# Altium project PCB_Backplane_Board.PrjPcb
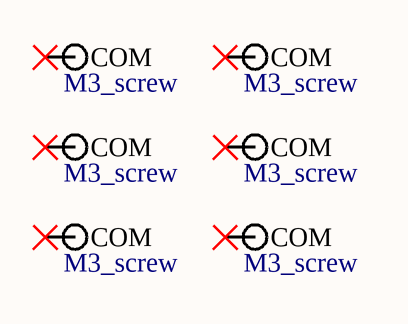
[diagram p0: Main.SchDoc]
10 sheets, 46 parts. Net scope: flat (ports and power ports of the same name join across sheets).
Board file: Backplane_Board.PcbDoc
Sheets:
  Main.SchDoc
  USB_hub.SchDoc
  Outgoing_connectors_1_to_3.SchDoc
  Outgoing_Connector_4.SchDoc
  Incoming_connectors.SchDoc
  SD_Card.SchDoc
  USB_hub2.SchDoc
  Outgoing_connectors_5_to_7.SchDoc
  Outgoing_Connector_8.SchDoc
  Incoming_connectors2.SchDoc

## Sheet Main.SchDoc
size A4

### Parts
TH1  M3_screw  [m3_w_tol_1p9]
TH2  M3_screw  [m3_w_tol_1p9]
TH3  M3_screw  [m3_w_tol_1p9]
TH4  M3_screw  [m3_w_tol_1p9]
TH5  M3_screw  [m3_w_tol_1p9]
TH6  M3_screw  [m3_w_tol_1p9]

### Nets

Not connected (* = marked no-connect by the designer): TH1 0(COM)*; TH2 0(COM)*; TH3 0(COM)*; TH4 0(COM)*; TH5 0(COM)*; TH6 0(COM)*

## Sheet USB_hub.SchDoc
size A4
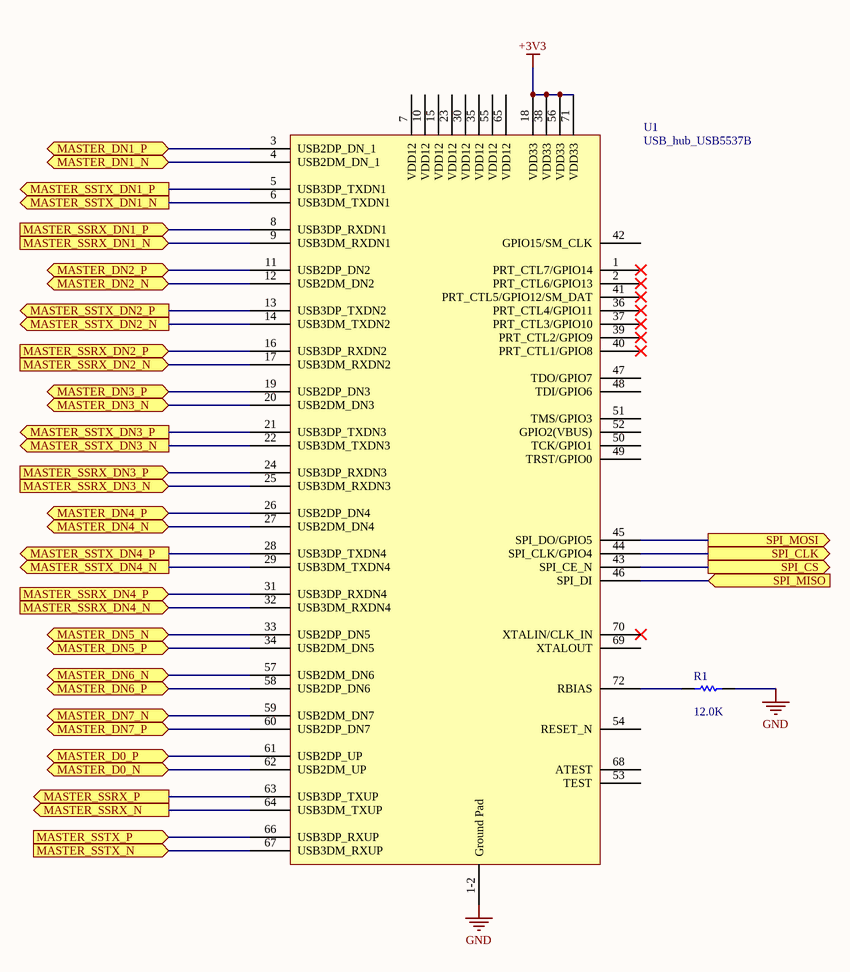
[diagram p1: USB_hub.SchDoc]

### Parts
R1  value 12.0K  [RESC6332]  (hidden comment: Res1)
U1  USB_hub_USB5537B  [QFN50P1000X1000X100_HS-73N]

### Ports
MASTER_D0_N (bidir), MASTER_D0_P (bidir), MASTER_DN1_N (bidir), MASTER_DN1_P (bidir), MASTER_DN2_N (bidir), MASTER_DN2_P (bidir), MASTER_DN3_N (bidir), MASTER_DN3_P (bidir), MASTER_DN4_N (bidir), MASTER_DN4_P (bidir), MASTER_DN5_N (bidir), MASTER_DN5_P (bidir), MASTER_DN6_N (bidir), MASTER_DN6_P (bidir), MASTER_DN7_N (bidir), MASTER_DN7_P (bidir), MASTER_SSRX_DN1_N (in), MASTER_SSRX_DN1_P (in), MASTER_SSRX_DN2_N (in), MASTER_SSRX_DN2_P (in), MASTER_SSRX_DN3_N (in), MASTER_SSRX_DN3_P (in), MASTER_SSRX_DN4_N (in), MASTER_SSRX_DN4_P (in), MASTER_SSRX_N (out), MASTER_SSRX_P (out), MASTER_SSTX_DN1_N (out), MASTER_SSTX_DN1_P (out), MASTER_SSTX_DN2_N (out), MASTER_SSTX_DN2_P (out), MASTER_SSTX_DN3_N (out), MASTER_SSTX_DN3_P (out), MASTER_SSTX_DN4_N (out), MASTER_SSTX_DN4_P (out), MASTER_SSTX_N (in), MASTER_SSTX_P (in), SPI_CLK (out), SPI_CS (out), SPI_MISO (in), SPI_MOSI (out)

### Nets
+3V3: U1.18(VDD33) U1.38(VDD33) U1.56(VDD33) U1.71(VDD33)
GND: R1.2 U1.1-2(Ground_Pad)
MASTER_D0_N: U1.62(USB2DM_UP) ; port MASTER_D0_N
MASTER_D0_P: U1.61(USB2DP_UP) ; port MASTER_D0_P
MASTER_DN1_N: U1.4(USB2DM_DN_1) ; port MASTER_DN1_N
MASTER_DN1_P: U1.3(USB2DP_DN_1) ; port MASTER_DN1_P
MASTER_DN2_N: U1.12(USB2DM_DN2) ; port MASTER_DN2_N
MASTER_DN2_P: U1.11(USB2DP_DN2) ; port MASTER_DN2_P
MASTER_DN3_N: U1.20(USB2DM_DN3) ; port MASTER_DN3_N
MASTER_DN3_P: U1.19(USB2DP_DN3) ; port MASTER_DN3_P
MASTER_DN4_N: U1.27(USB2DM_DN4) ; port MASTER_DN4_N
MASTER_DN4_P: U1.26(USB2DP_DN4) ; port MASTER_DN4_P
MASTER_DN5_N: U1.33(USB2DP_DN5) ; port MASTER_DN5_N
MASTER_DN5_P: U1.34(USB2DM_DN5) ; port MASTER_DN5_P
MASTER_DN6_N: U1.57(USB2DM_DN6) ; port MASTER_DN6_N
MASTER_DN6_P: U1.58(USB2DP_DN6) ; port MASTER_DN6_P
MASTER_DN7_N: U1.59(USB2DM_DN7) ; port MASTER_DN7_N
MASTER_DN7_P: U1.60(USB2DP_DN7) ; port MASTER_DN7_P
MASTER_SSRX_DN1_N: U1.9(USB3DM_RXDN1) ; port MASTER_SSRX_DN1_N
MASTER_SSRX_DN1_P: U1.8(USB3DP_RXDN1) ; port MASTER_SSRX_DN1_P
MASTER_SSRX_DN2_N: U1.17(USB3DM_RXDN2) ; port MASTER_SSRX_DN2_N
MASTER_SSRX_DN2_P: U1.16(USB3DP_RXDN2) ; port MASTER_SSRX_DN2_P
MASTER_SSRX_DN3_N: U1.25(USB3DM_RXDN3) ; port MASTER_SSRX_DN3_N
MASTER_SSRX_DN3_P: U1.24(USB3DP_RXDN3) ; port MASTER_SSRX_DN3_P
MASTER_SSRX_DN4_N: U1.32(USB3DM_RXDN4) ; port MASTER_SSRX_DN4_N
MASTER_SSRX_DN4_P: U1.31(USB3DP_RXDN4) ; port MASTER_SSRX_DN4_P
MASTER_SSRX_N: U1.64(USB3DM_TXUP) ; port MASTER_SSRX_N
MASTER_SSRX_P: U1.63(USB3DP_TXUP) ; port MASTER_SSRX_P
NetC1_2: U1.67(USB3DM_RXUP) ; port MASTER_SSTX_N
NetC2_2: U1.66(USB3DP_RXUP) ; port MASTER_SSTX_P
NetC3_2: U1.22(USB3DM_TXDN3) ; port MASTER_SSTX_DN3_N
NetC4_2: U1.21(USB3DP_TXDN3) ; port MASTER_SSTX_DN3_P
NetC5_2: U1.6(USB3DM_TXDN1) ; port MASTER_SSTX_DN1_N
NetC6_2: U1.5(USB3DP_TXDN1) ; port MASTER_SSTX_DN1_P
NetC7_2: U1.14(USB3DM_TXDN2) ; port MASTER_SSTX_DN2_N
NetC8_2: U1.13(USB3DP_TXDN2) ; port MASTER_SSTX_DN2_P
NetC9_2: U1.29(USB3DM_TXDN4) ; port MASTER_SSTX_DN4_N
NetC10_2: U1.28(USB3DP_TXDN4) ; port MASTER_SSTX_DN4_P
NetJ1_2: U1.43(SPI_CE_N) ; port SPI_CS
NetJ1_3: U1.45(SPI_DO/GPIO5) ; port SPI_MOSI
NetJ1_5: U1.44(SPI_CLK/GPIO4) ; port SPI_CLK
NetJ1_7: U1.46(SPI_DI) ; port SPI_MISO
NetR1_1: R1.1 U1.72(RBIAS)

Not connected (* = marked no-connect by the designer): U1 1(PRT_CTL7/GPIO14)* 2(PRT_CTL6/GPIO13)* 7(VDD12) 10(VDD12) 15(VDD12) 23(VDD12) 30(VDD12) 35(VDD12) 36(PRT_CTL4/GPIO11)* 37(PRT_CTL3/GPIO10)* 39(PRT_CTL2/GPIO9)* 40(PRT_CTL1/GPIO8)* 41(PRT_CTL5/GPIO12/SM_DAT)* 42(GPIO15/SM_CLK) 47(TDO/GPIO7) 48(TDI/GPIO6) 49(TRST/GPIO0) 50(TCK/GPIO1) 51(TMS/GPIO3) 52(GPIO2(VBUS)) 53(TEST) 54(RESET_N) 55(VDD12) 65(VDD12) 68(ATEST) 69(XTALOUT) 70(XTALIN/CLK_IN)*

### Library data of the parts
R1 = Res1: Resistor; Published: 8-Jun-2000; LatestRevisionDate: 17-Jul-2002; LatestRevisionNote: Re-released for DXP Platform.; PackageReference: AXIAL-0.3; Publisher: Altium Limited; PackageDescription: Axial Device, Thru-Hole; 2 Leads; 0.3 in Pin Spacing
U1 = USB_hub_USB5537B: https://media.digikey.com/pdf/Data%20Sheets/Microchip%20PDFs/USB5537B.pdf

## Sheet Outgoing_connectors_1_to_3.SchDoc
size A4
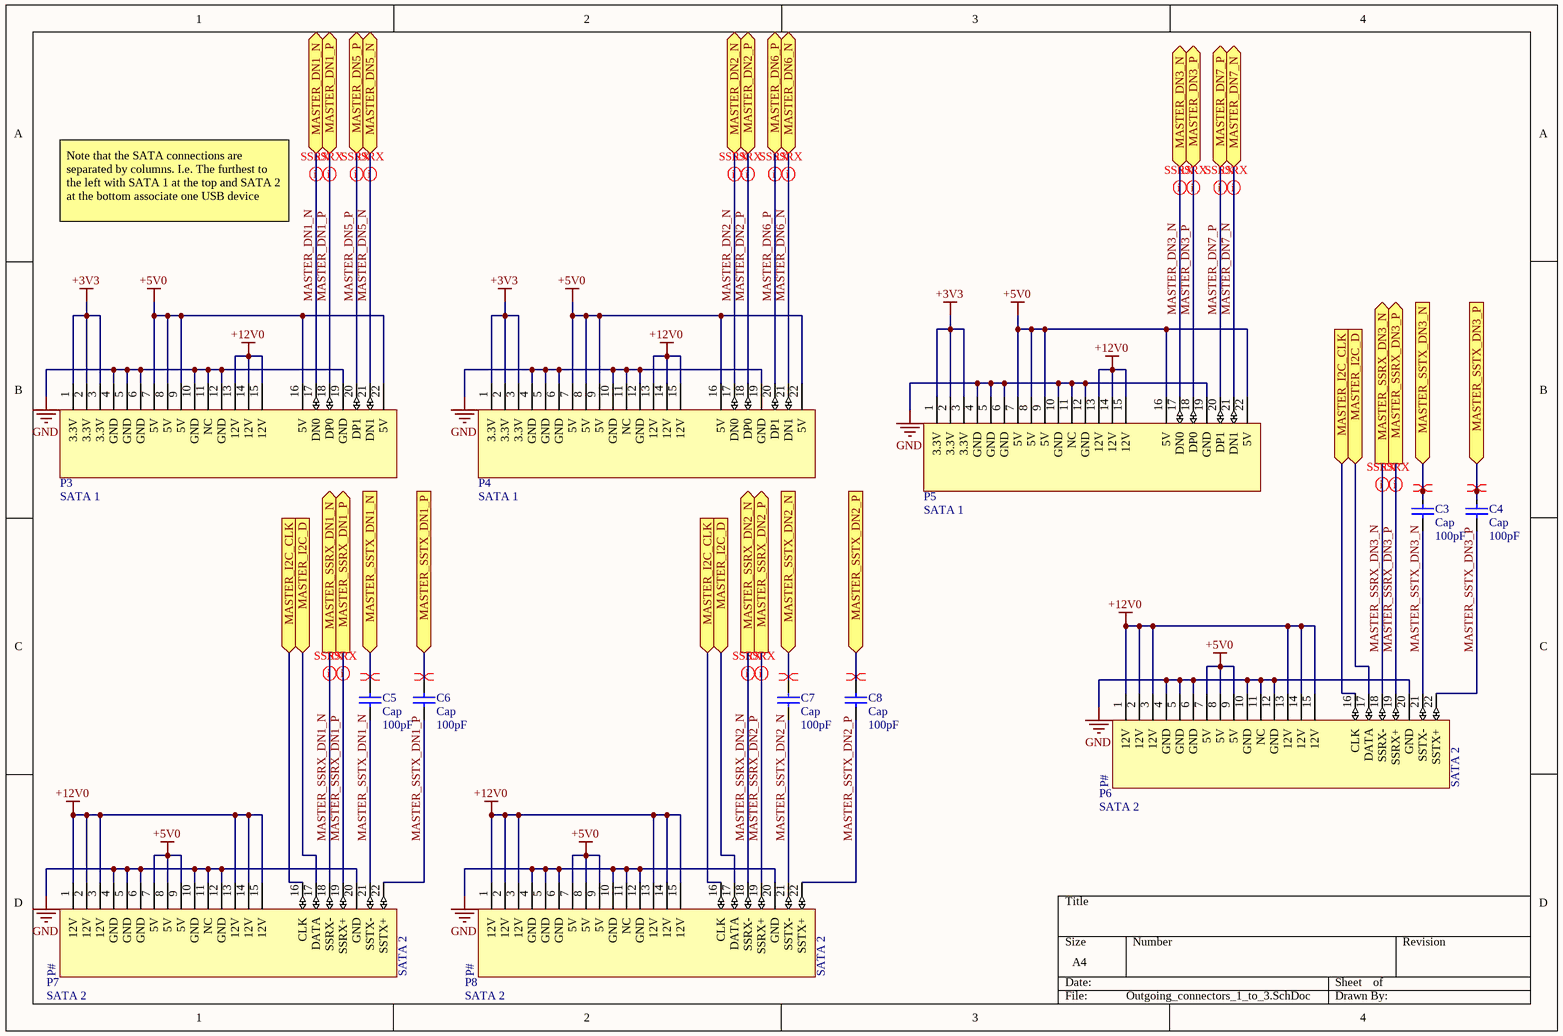
[diagram p2: Outgoing_connectors_1_to_3.SchDoc]

### Parts
C3  Cap  value 100pF  [RAD-0.3]
C4  Cap  value 100pF  [RAD-0.3]
C5  Cap  value 100pF  [RAD-0.3]
C6  Cap  value 100pF  [RAD-0.3]
C7  Cap  value 100pF  [RAD-0.3]
C8  Cap  value 100pF  [RAD-0.3]
P3  SATA 1  [Amphenol 10017660-001LF]
P4  SATA 1  [Amphenol 10017660-001LF]
P5  SATA 1  [Amphenol 10017660-001LF]
P6  SATA 2  [Amphenol 10017660-001LF]
P7  SATA 2  [Amphenol 10017660-001LF]
P8  SATA 2  [Amphenol 10017660-001LF]

### Ports
MASTER_DN1_N (bidir), MASTER_DN1_P (bidir), MASTER_DN2_N (bidir), MASTER_DN2_P (bidir), MASTER_DN3_N (bidir), MASTER_DN3_P (bidir), MASTER_DN5_N (bidir), MASTER_DN5_P (bidir), MASTER_DN6_N (bidir), MASTER_DN6_P (bidir), MASTER_DN7_N (bidir), MASTER_DN7_P (bidir), MASTER_I2C_CLK (in), MASTER_I2C_D (in), MASTER_SSRX_DN1_N (out), MASTER_SSRX_DN1_P (out), MASTER_SSRX_DN2_N (out), MASTER_SSRX_DN2_P (out), MASTER_SSRX_DN3_N (out), MASTER_SSRX_DN3_P (out), MASTER_SSTX_DN1_N (in), MASTER_SSTX_DN1_P (in), MASTER_SSTX_DN2_N (in), MASTER_SSTX_DN2_P (in), MASTER_SSTX_DN3_N (in), MASTER_SSTX_DN3_P (in)

### Nets
+3V3: P3.1(3.3V) P3.2(3.3V) P3.3(3.3V) P4.1(3.3V) P4.2(3.3V) P4.3(3.3V) P5.1(3.3V) P5.2(3.3V) P5.3(3.3V)
+5V0: P3.7(5V) P3.8(5V) P3.9(5V) P3.16(5V) P3.22(5V) P4.7(5V) P4.8(5V) P4.9(5V) P4.16(5V) P4.22(5V) P5.7(5V) P5.8(5V) P5.9(5V) P5.16(5V) P5.22(5V) P6.7(5V) P6.8(5V) P6.9(5V) P7.7(5V) P7.8(5V) P7.9(5V) P8.7(5V) P8.8(5V) P8.9(5V)
+12V0: P3.13(12V) P3.14(12V) P3.15(12V) P4.13(12V) P4.14(12V) P4.15(12V) P5.13(12V) P5.14(12V) P5.15(12V) P6.1(12V) P6.2(12V) P6.3(12V) P6.13(12V) P6.14(12V) P6.15(12V) P7.1(12V) P7.2(12V) P7.3(12V) P7.13(12V) P7.14(12V) P7.15(12V) P8.1(12V) P8.2(12V) P8.3(12V) P8.13(12V) P8.14(12V) P8.15(12V)
GND: P3.4(GND) P3.5(GND) P3.6(GND) P3.10(GND) P3.11(NC) P3.12(GND) P3.19(GND) P4.4(GND) P4.5(GND) P4.6(GND) P4.10(GND) P4.11(NC) P4.12(GND) P4.19(GND) P5.4(GND) P5.5(GND) P5.6(GND) P5.10(GND) P5.11(NC) P5.12(GND) P5.19(GND) P6.4(GND) P6.5(GND) P6.6(GND) P6.10(GND) P6.11(NC) P6.12(GND) P6.20(GND) P7.4(GND) P7.5(GND) P7.6(GND) P7.10(GND) P7.11(NC) P7.12(GND) P7.20(GND) P8.4(GND) P8.5(GND) P8.6(GND) P8.10(GND) P8.11(NC) P8.12(GND) P8.20(GND)
MASTER_DN1_N: P3.17(DN0) ; port MASTER_DN1_N
MASTER_DN1_P: P3.18(DP0) ; port MASTER_DN1_P
MASTER_DN2_N: P4.17(DN0) ; port MASTER_DN2_N
MASTER_DN2_P: P4.18(DP0) ; port MASTER_DN2_P
MASTER_DN3_N: P5.17(DN0) ; port MASTER_DN3_N
MASTER_DN3_P: P5.18(DP0) ; port MASTER_DN3_P
MASTER_DN5_N: P3.21(DN1) ; port MASTER_DN5_N
MASTER_DN5_P: P3.20(DP1) ; port MASTER_DN5_P
MASTER_DN6_N: P4.21(DN1) ; port MASTER_DN6_N
MASTER_DN6_P: P4.20(DP1) ; port MASTER_DN6_P
MASTER_DN7_N: P5.21(DN1) ; port MASTER_DN7_N
MASTER_DN7_P: P5.20(DP1) ; port MASTER_DN7_P
MASTER_SSRX_DN1_N: P7.18(SSRX-) ; port MASTER_SSRX_DN1_N
MASTER_SSRX_DN1_P: P7.19(SSRX+) ; port MASTER_SSRX_DN1_P
MASTER_SSRX_DN2_N: P8.18(SSRX-) ; port MASTER_SSRX_DN2_N
MASTER_SSRX_DN2_P: P8.19(SSRX+) ; port MASTER_SSRX_DN2_P
MASTER_SSRX_DN3_N: P6.18(SSRX-) ; port MASTER_SSRX_DN3_N
MASTER_SSRX_DN3_P: P6.19(SSRX+) ; port MASTER_SSRX_DN3_P
MASTER_SSTX_DN1_N: C5.1 P7.21(SSTX-)
MASTER_SSTX_DN1_P: C6.1 P7.22(SSTX+)
MASTER_SSTX_DN2_N: C7.1 P8.21(SSTX-)
MASTER_SSTX_DN2_P: C8.1 P8.22(SSTX+)
MASTER_SSTX_DN3_N: C3.1 P6.21(SSTX-)
MASTER_SSTX_DN3_P: C4.1 P6.22(SSTX+)
NetC3_2: C3.2 ; port MASTER_SSTX_DN3_N
NetC4_2: C4.2 ; port MASTER_SSTX_DN3_P
NetC5_2: C5.2 ; port MASTER_SSTX_DN1_N
NetC6_2: C6.2 ; port MASTER_SSTX_DN1_P
NetC7_2: C7.2 ; port MASTER_SSTX_DN2_N
NetC8_2: C8.2 ; port MASTER_SSTX_DN2_P
NetP2_16: P6.16(CLK) P7.16(CLK) P8.16(CLK) ; port MASTER_I2C_CLK
NetP2_17: P6.17(DATA) P7.17(DATA) P8.17(DATA) ; port MASTER_I2C_D

### Layout directives
differential pair; rule Signal Stimulus [Kind - Single Pulse    Level - High    Start Time = 0.000    Stop Time = 200.0p    Period Time = 400.0p]: (no net found under the mark), MASTER_DN1_N, MASTER_DN1_P, MASTER_DN2_N, MASTER_DN2_P, MASTER_DN3_N, MASTER_DN3_P, MASTER_DN5_N, MASTER_DN5_P, MASTER_DN6_N, MASTER_DN6_P, MASTER_DN7_N, MASTER_DN7_P, MASTER_SSRX_DN1_N, MASTER_SSRX_DN1_P, MASTER_SSRX_DN2_N, MASTER_SSRX_DN2_P, MASTER_SSRX_DN3_N, MASTER_SSRX_DN3_P

### Notes on the sheet
- Note that the SATA connections are separated by columns. I.e. The furthest to the left with SATA 1 at the top and SATA 2 at the bottom associate one USB device
- (in symbol SATA 2) P#

### Library data of the parts
C3-C8 = Cap: Capacitor; Published: 8-Jun-2000; LatestRevisionDate: 17-Jul-2002; LatestRevisionNote: Re-released for DXP Platform.; PackageReference: RAD-0.3; Publisher: Altium Limited; PackageDescription: Radial Cap, Thru-Hole; 2 Leads; 0.3 in Pin Spacing
P3-P5 = SATA 1: SATA connector. / Connector 1 for option 1 as per Spec; Supplier 1: Digi-Key
P6-P8 = SATA 2: SATA connector. / Connector 2 for option 1 as per Spec; Supplier 1: Digi-Key

## Sheet Outgoing_Connector_4.SchDoc
size A4
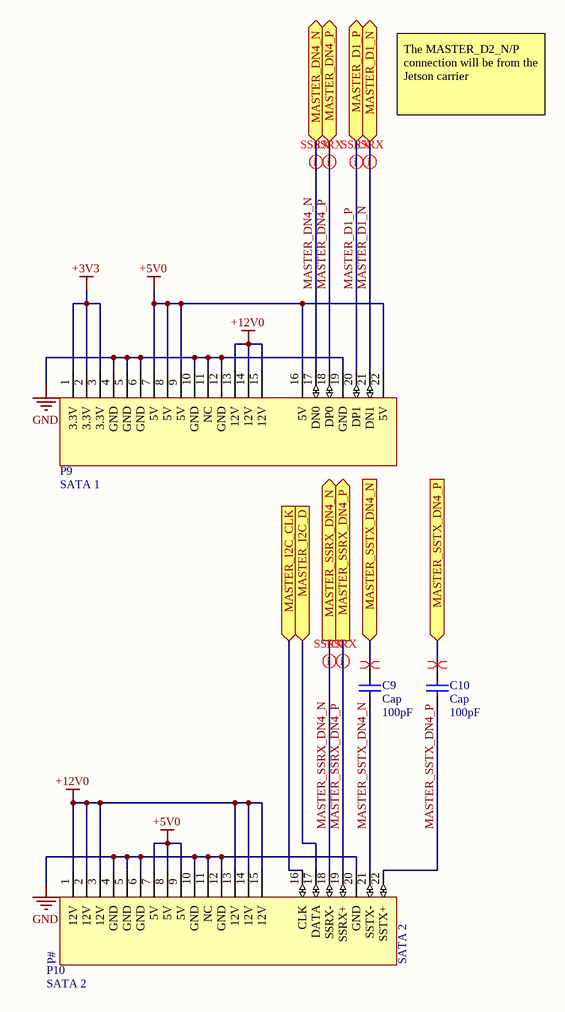
[diagram p3: Outgoing_Connector_4.SchDoc]

### Parts
C9  Cap  value 100pF  [RAD-0.3]
C10  Cap  value 100pF  [RAD-0.3]
P9  SATA 1  [Amphenol 10017660-001LF]
P10  SATA 2  [Amphenol 10017660-001LF]

### Ports
MASTER_D1_N (bidir), MASTER_D1_P (bidir), MASTER_DN4_N (bidir), MASTER_DN4_P (bidir), MASTER_I2C_CLK (in), MASTER_I2C_D (in), MASTER_SSRX_DN4_N (out), MASTER_SSRX_DN4_P (out), MASTER_SSTX_DN4_N (in), MASTER_SSTX_DN4_P (in)

### Nets
+3V3: P9.1(3.3V) P9.2(3.3V) P9.3(3.3V)
+5V0: P9.7(5V) P9.8(5V) P9.9(5V) P9.16(5V) P9.22(5V) P10.7(5V) P10.8(5V) P10.9(5V)
+12V0: P9.13(12V) P9.14(12V) P9.15(12V) P10.1(12V) P10.2(12V) P10.3(12V) P10.13(12V) P10.14(12V) P10.15(12V)
GND: P9.4(GND) P9.5(GND) P9.6(GND) P9.10(GND) P9.11(NC) P9.12(GND) P9.19(GND) P10.4(GND) P10.5(GND) P10.6(GND) P10.10(GND) P10.11(NC) P10.12(GND) P10.20(GND)
MASTER_D1_N: P9.21(DN1) ; port MASTER_D1_N
MASTER_D1_P: P9.20(DP1) ; port MASTER_D1_P
MASTER_DN4_N: P9.17(DN0) ; port MASTER_DN4_N
MASTER_DN4_P: P9.18(DP0) ; port MASTER_DN4_P
MASTER_SSRX_DN4_N: P10.18(SSRX-) ; port MASTER_SSRX_DN4_N
MASTER_SSRX_DN4_P: P10.19(SSRX+) ; port MASTER_SSRX_DN4_P
MASTER_SSTX_DN4_N: C9.1 P10.21(SSTX-)
MASTER_SSTX_DN4_P: C10.1 P10.22(SSTX+)
NetC9_2: C9.2 ; port MASTER_SSTX_DN4_N
NetC10_2: C10.2 ; port MASTER_SSTX_DN4_P
NetP2_16: P10.16(CLK) ; port MASTER_I2C_CLK
NetP2_17: P10.17(DATA) ; port MASTER_I2C_D

### Layout directives
differential pair; rule Signal Stimulus [Kind - Single Pulse    Level - High    Start Time = 0.000    Stop Time = 200.0p    Period Time = 400.0p]: (no net found under the mark), MASTER_D1_N, MASTER_D1_P, MASTER_DN4_N, MASTER_DN4_P, MASTER_SSRX_DN4_N, MASTER_SSRX_DN4_P

### Notes on the sheet
- The MASTER_D2_N/P connection will be from the Jetson carrier
- (in symbol SATA 2) P#

### Library data of the parts
C9 C10 = Cap: Capacitor; Published: 8-Jun-2000; LatestRevisionDate: 17-Jul-2002; LatestRevisionNote: Re-released for DXP Platform.; PackageReference: RAD-0.3; Publisher: Altium Limited; PackageDescription: Radial Cap, Thru-Hole; 2 Leads; 0.3 in Pin Spacing
P9 = SATA 1: as P3 on sheet Outgoing_connectors_1_to_3; Supplier 1: Digi-Key
P10 = SATA 2: as P6 on sheet Outgoing_connectors_1_to_3; Supplier 1: Digi-Key

## Sheet Incoming_connectors.SchDoc
size A4
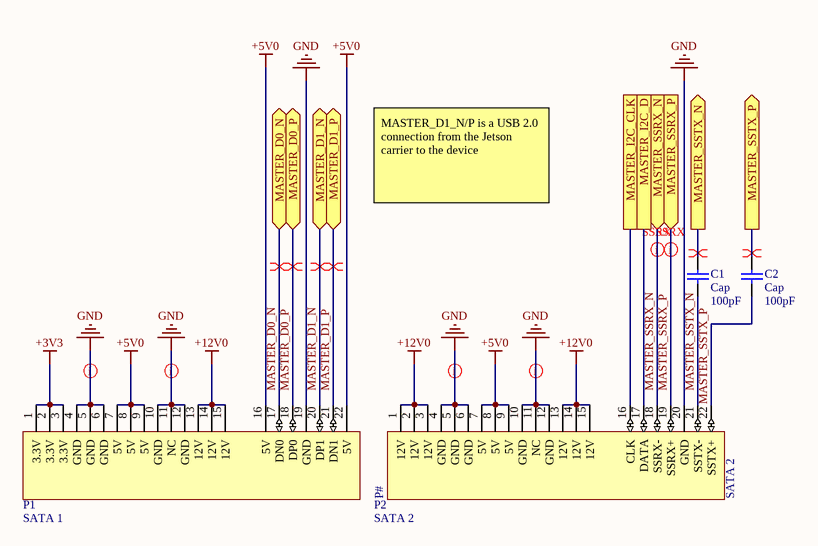
[diagram p4: Incoming_connectors.SchDoc]

### Parts
C1  Cap  value 100pF  [RAD-0.3]
C2  Cap  value 100pF  [RAD-0.3]
P1  SATA 1  [Amphenol 10017660-001LF]
P2  SATA 2  [Amphenol 10017660-001LF]

### Ports
MASTER_D0_N (bidir), MASTER_D0_P (bidir), MASTER_D1_N (bidir), MASTER_D1_P (bidir), MASTER_I2C_CLK, MASTER_I2C_D, MASTER_SSRX_N (in), MASTER_SSRX_P (in), MASTER_SSTX_N (out), MASTER_SSTX_P (out)

### Nets
+3V3: P1.1(3.3V) P1.2(3.3V) P1.3(3.3V)
+5V0: P1.7(5V) P1.8(5V) P1.9(5V) P1.16(5V) P1.22(5V) P2.7(5V) P2.8(5V) P2.9(5V)
+12V0: P1.13(12V) P1.14(12V) P1.15(12V) P2.1(12V) P2.2(12V) P2.3(12V) P2.13(12V) P2.14(12V) P2.15(12V)
GND: P1.4(GND) P1.5(GND) P1.6(GND) P1.10(GND) P1.11(NC) P1.12(GND) P1.19(GND) P2.4(GND) P2.5(GND) P2.6(GND) P2.10(GND) P2.11(NC) P2.12(GND) P2.20(GND)
MASTER_D0_N: P1.17(DN0) ; port MASTER_D0_N
MASTER_D0_P: P1.18(DP0) ; port MASTER_D0_P
MASTER_D1_N: P1.20(DP1) ; port MASTER_D1_N
MASTER_D1_P: P1.21(DN1) ; port MASTER_D1_P
MASTER_SSRX_N: P2.18(SSRX-) ; port MASTER_SSRX_N
MASTER_SSRX_P: P2.19(SSRX+) ; port MASTER_SSRX_P
MASTER_SSTX_N: C1.1 P2.21(SSTX-)
MASTER_SSTX_P: C2.1 P2.22(SSTX+)
NetC1_2: C1.2 ; port MASTER_SSTX_N
NetC2_2: C2.2 ; port MASTER_SSTX_P
NetP2_16: P2.16(CLK) ; port MASTER_I2C_CLK
NetP2_17: P2.17(DATA) ; port MASTER_I2C_D

### Layout directives
rule Width Constraint [Pref Width = 75mil    Min Width = 50mil    Max Width = 1000mil]: GND
differential pair; rule Signal Stimulus [Kind - Single Pulse    Level - High    Start Time = 0.000    Stop Time = 200.0p    Period Time = 400.0p]: (no net found under the mark), MASTER_SSRX_N, MASTER_SSRX_P
differential pair; rule Signal Stimulus [Kind - Single Pulse    Level - High    Start Time = 0.000    Stop Time = 2.083n    Period Time = 4.167n]: MASTER_D0_N, MASTER_D0_P, MASTER_D1_N, MASTER_D1_P

### Notes on the sheet
- MASTER_D1_N/P is a USB 2.0  connection from the Jetson carrier to the device
- (in symbol SATA 2) P#

### Library data of the parts
C1 C2 = Cap: Capacitor; Published: 8-Jun-2000; LatestRevisionDate: 17-Jul-2002; LatestRevisionNote: Re-released for DXP Platform.; PackageReference: RAD-0.3; Publisher: Altium Limited; PackageDescription: Radial Cap, Thru-Hole; 2 Leads; 0.3 in Pin Spacing
P1 = SATA 1: as P3 on sheet Outgoing_connectors_1_to_3; Supplier 1: Digi-Key
P2 = SATA 2: as P6 on sheet Outgoing_connectors_1_to_3; Supplier 1: Digi-Key

## Sheet SD_Card.SchDoc
size A4
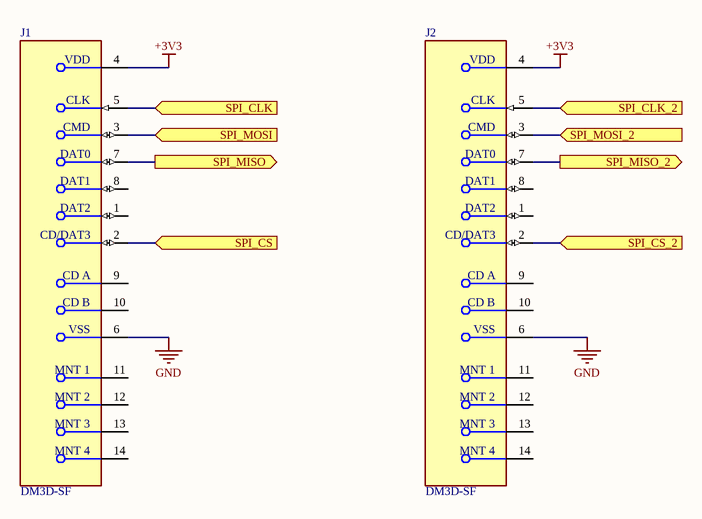
[diagram p5: SD_Card.SchDoc]

### Parts
J1  DM3D-SF  [FP-DM3D-SF-MFG]
J2  DM3D-SF  [FP-DM3D-SF-MFG]

### Ports
SPI_CLK (in), SPI_CLK_2 (in), SPI_CS (in), SPI_CS_2 (in), SPI_MISO (out), SPI_MISO_2 (out), SPI_MOSI (in), SPI_MOSI_2 (in)

### Nets
+3V3: J1.4(VDD) J2.4(VDD)
GND: J1.6(VSS) J2.6(VSS)
NetJ1_2: J1.2(CD/DAT3) ; port SPI_CS
NetJ1_3: J1.3(CMD) ; port SPI_MOSI
NetJ1_5: J1.5(CLK) ; port SPI_CLK
NetJ1_7: J1.7(DAT0) ; port SPI_MISO
NetJ2_2: J2.2(CD/DAT3) ; port SPI_CS_2
NetJ2_3: J2.3(CMD) ; port SPI_MOSI_2
NetJ2_5: J2.5(CLK) ; port SPI_CLK_2
NetJ2_7: J2.7(DAT0) ; port SPI_MISO_2

Not connected (* = marked no-connect by the designer): J1 1(DAT2) 8(DAT1) 9(CD_A) 10(CD_B) 11(MNT_1) 12(MNT_2) 13(MNT_3) 14(MNT_4); J2 1(DAT2) 8(DAT1) 9(CD_A) 10(CD_B) 11(MNT_1) 12(MNT_2) 13(MNT_3) 14(MNT_4)

### Library data of the parts
J1 J2 = CMP-2000-06166-2: CONN MICRO SD CARD PUSH-PULL; Insulation Resistance: 1GR; Max Voltage Rating (AC): 125V; Gender: Female; Contact Resistance: 100mR; Current Rating: 500mA; Pitch: 1.1mm; Connector Type: Connector; Number of Contacts: 8; Contact Plating: Gold; Number of Rows: 1; Termination: Solder; Contact Material: Copper Alloy; REACH SVHC: No SVHC; Voltage Rating (AC): 125V; Packaging: Tape and Reel; Housing Material: Polymer; Max Operating Temperature: 85°C; Package Quantity: 1; Min Operating Temperature: -25°C; Lead Free: Lead Free; Orientation: Right Angle; Radiation Hardening: No; Flammability Rating: UL94 V-0; Mount: Surface Mount; Depth: 11.45mm; Max Current Rating: 500mA; Length: 11.95mm; Width: 11.95mm

## Sheet USB_hub2.SchDoc
size A4
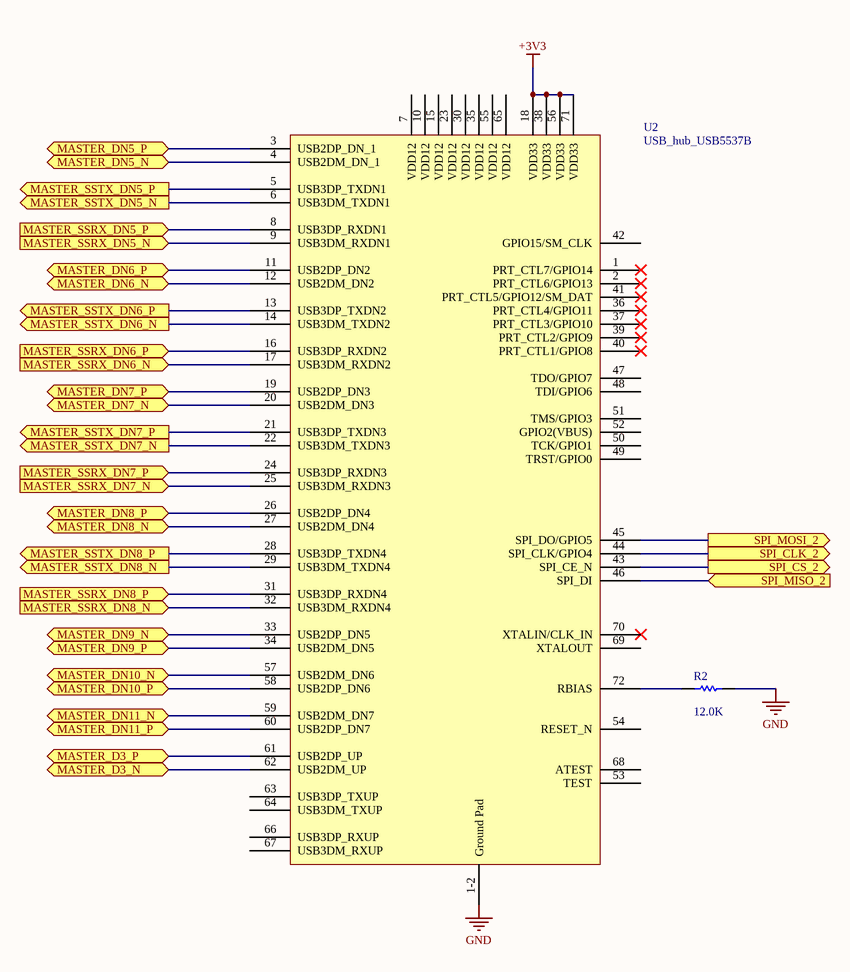
[diagram p6: USB_hub2.SchDoc]

### Parts
R2  value 12.0K  [RESC6332]  (hidden comment: Res1)
U2  USB_hub_USB5537B  [QFN50P1000X1000X100_HS-73N]

### Ports
MASTER_D3_N (bidir), MASTER_D3_P (bidir), MASTER_DN5_N (bidir), MASTER_DN5_P (bidir), MASTER_DN6_N (bidir), MASTER_DN6_P (bidir), MASTER_DN7_N (bidir), MASTER_DN7_P (bidir), MASTER_DN8_N (bidir), MASTER_DN8_P (bidir), MASTER_DN9_N (bidir), MASTER_DN9_P (bidir), MASTER_DN10_N (bidir), MASTER_DN10_P (bidir), MASTER_DN11_N (bidir), MASTER_DN11_P (bidir), MASTER_SSRX_DN5_N (in), MASTER_SSRX_DN5_P (in), MASTER_SSRX_DN6_N (in), MASTER_SSRX_DN6_P (in), MASTER_SSRX_DN7_N (in), MASTER_SSRX_DN7_P (in), MASTER_SSRX_DN8_N (in), MASTER_SSRX_DN8_P (in), MASTER_SSTX_DN5_N (out), MASTER_SSTX_DN5_P (out), MASTER_SSTX_DN6_N (out), MASTER_SSTX_DN6_P (out), MASTER_SSTX_DN7_N (out), MASTER_SSTX_DN7_P (out), MASTER_SSTX_DN8_N (out), MASTER_SSTX_DN8_P (out), SPI_CLK_2 (out), SPI_CS_2 (out), SPI_MISO_2 (in), SPI_MOSI_2 (out)

### Nets
+3V3: U2.18(VDD33) U2.38(VDD33) U2.56(VDD33) U2.71(VDD33)
GND: R2.2 U2.1-2(Ground_Pad)
 MASTER_DN8_N: U2.27(USB2DM_DN4) ; port MASTER_DN8_N
 MASTER_DN8_P: U2.26(USB2DP_DN4) ; port MASTER_DN8_P
MASTER_D3_N: U2.62(USB2DM_UP) ; port MASTER_D3_N
MASTER_D3_P: U2.61(USB2DP_UP) ; port MASTER_D3_P
MASTER_DN5_N: U2.4(USB2DM_DN_1) ; port MASTER_DN5_N
MASTER_DN5_P: U2.3(USB2DP_DN_1) ; port MASTER_DN5_P
MASTER_DN6_N: U2.12(USB2DM_DN2) ; port MASTER_DN6_N
MASTER_DN6_P: U2.11(USB2DP_DN2) ; port MASTER_DN6_P
MASTER_DN7_N: U2.20(USB2DM_DN3) ; port MASTER_DN7_N
MASTER_DN7_P: U2.19(USB2DP_DN3) ; port MASTER_DN7_P
MASTER_DN9_N: U2.33(USB2DP_DN5) ; port MASTER_DN9_N
MASTER_DN9_P: U2.34(USB2DM_DN5) ; port MASTER_DN9_P
MASTER_DN10_N: U2.57(USB2DM_DN6) ; port MASTER_DN10_N
MASTER_DN10_P: U2.58(USB2DP_DN6) ; port MASTER_DN10_P
MASTER_DN11_N: U2.59(USB2DM_DN7) ; port MASTER_DN11_N
MASTER_DN11_P: U2.60(USB2DP_DN7) ; port MASTER_DN11_P
MASTER_SSRX_DN5_N: U2.9(USB3DM_RXDN1) ; port MASTER_SSRX_DN5_N
MASTER_SSRX_DN5_P: U2.8(USB3DP_RXDN1) ; port MASTER_SSRX_DN5_P
MASTER_SSRX_DN6_N: U2.17(USB3DM_RXDN2) ; port MASTER_SSRX_DN6_N
MASTER_SSRX_DN6_P: U2.16(USB3DP_RXDN2) ; port MASTER_SSRX_DN6_P
MASTER_SSRX_DN7_N: U2.25(USB3DM_RXDN3) ; port MASTER_SSRX_DN7_N
MASTER_SSRX_DN7_P: U2.24(USB3DP_RXDN3) ; port MASTER_SSRX_DN7_P
MASTER_SSRX_DN8_N: U2.32(USB3DM_RXDN4) ; port MASTER_SSRX_DN8_N
MASTER_SSRX_DN8_P: U2.31(USB3DP_RXDN4) ; port MASTER_SSRX_DN8_P
NetC11_1: U2.13(USB3DP_TXDN2) ; port MASTER_SSTX_DN6_P
NetC12_1: U2.14(USB3DM_TXDN2) ; port MASTER_SSTX_DN6_N
NetC13_2: U2.21(USB3DP_TXDN3) ; port MASTER_SSTX_DN7_P
NetC14_2: U2.22(USB3DM_TXDN3) ; port MASTER_SSTX_DN7_N
NetC15_2: U2.6(USB3DM_TXDN1) ; port MASTER_SSTX_DN5_N
NetC16_2: U2.5(USB3DP_TXDN1) ; port MASTER_SSTX_DN5_P
NetC17_2: U2.28(USB3DP_TXDN4) ; port MASTER_SSTX_DN8_P
NetC18_2: U2.29(USB3DM_TXDN4) ; port MASTER_SSTX_DN8_N
NetJ2_2: U2.43(SPI_CE_N) ; port SPI_CS_2
NetJ2_3: U2.45(SPI_DO/GPIO5) ; port SPI_MOSI_2
NetJ2_5: U2.44(SPI_CLK/GPIO4) ; port SPI_CLK_2
NetJ2_7: U2.46(SPI_DI) ; port SPI_MISO_2
NetR2_1: R2.1 U2.72(RBIAS)

Not connected (* = marked no-connect by the designer): U2 1(PRT_CTL7/GPIO14)* 2(PRT_CTL6/GPIO13)* 7(VDD12) 10(VDD12) 15(VDD12) 23(VDD12) 30(VDD12) 35(VDD12) 36(PRT_CTL4/GPIO11)* 37(PRT_CTL3/GPIO10)* 39(PRT_CTL2/GPIO9)* 40(PRT_CTL1/GPIO8)* 41(PRT_CTL5/GPIO12/SM_DAT)* 42(GPIO15/SM_CLK) 47(TDO/GPIO7) 48(TDI/GPIO6) 49(TRST/GPIO0) 50(TCK/GPIO1) 51(TMS/GPIO3) 52(GPIO2(VBUS)) 53(TEST) 54(RESET_N) 55(VDD12) 63(USB3DP_TXUP) 64(USB3DM_TXUP) 65(VDD12) 66(USB3DP_RXUP) 67(USB3DM_RXUP) 68(ATEST) 69(XTALOUT) 70(XTALIN/CLK_IN)*

### Library data of the parts
R2 = Res1: Resistor; Published: 8-Jun-2000; LatestRevisionDate: 17-Jul-2002; LatestRevisionNote: Re-released for DXP Platform.; PackageReference: AXIAL-0.3; Publisher: Altium Limited; PackageDescription: Axial Device, Thru-Hole; 2 Leads; 0.3 in Pin Spacing
U2 = USB_hub_USB5537B: as U1 on sheet USB_hub

## Sheet Outgoing_connectors_5_to_7.SchDoc
size A4
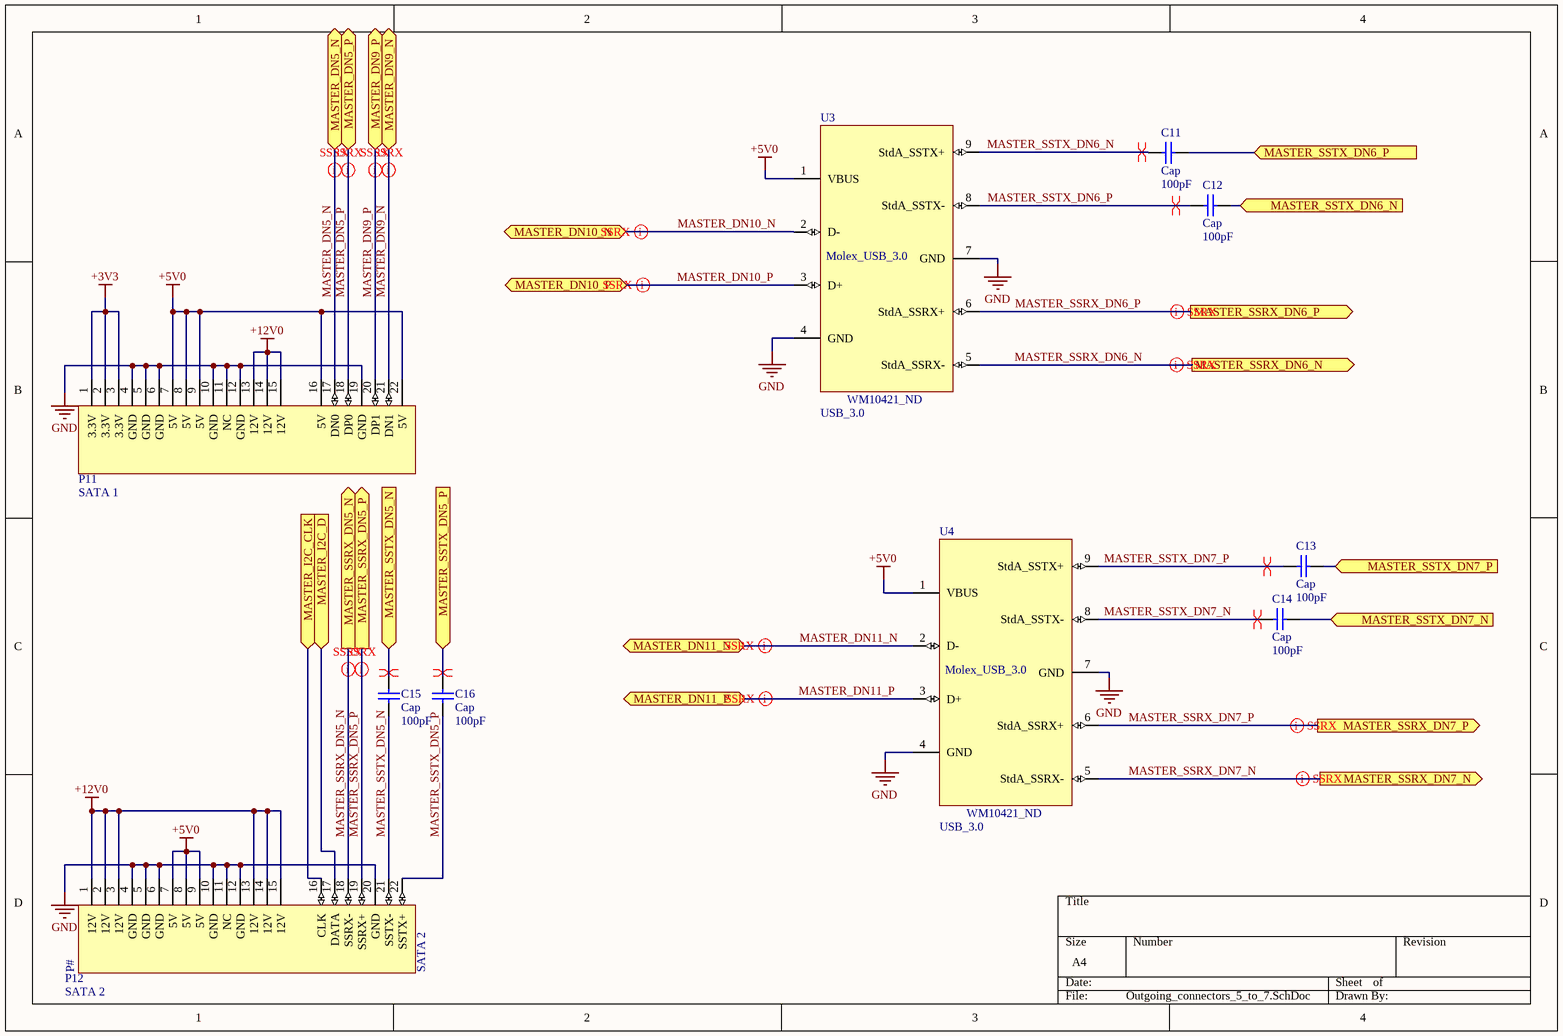
[diagram p7: Outgoing_connectors_5_to_7.SchDoc]

### Parts
C11  Cap  value 100pF  [RAD-0.3]
C12  Cap  value 100pF  [RAD-0.3]
C13  Cap  value 100pF  [RAD-0.3]
C14  Cap  value 100pF  [RAD-0.3]
C15  Cap  value 100pF  [RAD-0.3]
C16  Cap  value 100pF  [RAD-0.3]
P11  SATA 1  [Amphenol 10017660-001LF]
P12  SATA 2  [Amphenol 10017660-001LF]
U3  USB_3.0  [Molex_USB_3.0_WM10421_ND]
U4  USB_3.0  [Molex_USB_3.0_WM10421_ND]

### Ports
MASTER_DN5_N (bidir), MASTER_DN5_P (bidir), MASTER_DN9_N (bidir), MASTER_DN9_P (bidir), MASTER_DN10_N (bidir), MASTER_DN10_P (bidir), MASTER_DN11_N (bidir), MASTER_DN11_P (bidir), MASTER_I2C_CLK (in), MASTER_I2C_D (in), MASTER_SSRX_DN5_N (out), MASTER_SSRX_DN5_P (out), MASTER_SSRX_DN6_N (out), MASTER_SSRX_DN6_P (out), MASTER_SSRX_DN7_N (out), MASTER_SSRX_DN7_P (out), MASTER_SSTX_DN5_N (in), MASTER_SSTX_DN5_P (in), MASTER_SSTX_DN6_N (in), MASTER_SSTX_DN6_P (in), MASTER_SSTX_DN7_N (in), MASTER_SSTX_DN7_P (in)

### Nets
+3V3: P11.1(3.3V) P11.2(3.3V) P11.3(3.3V)
+5V0: P11.7(5V) P11.8(5V) P11.9(5V) P11.16(5V) P11.22(5V) P12.7(5V) P12.8(5V) P12.9(5V) U3.1(VBUS) U4.1(VBUS)
+12V0: P11.13(12V) P11.14(12V) P11.15(12V) P12.1(12V) P12.2(12V) P12.3(12V) P12.13(12V) P12.14(12V) P12.15(12V)
GND: P11.4(GND) P11.5(GND) P11.6(GND) P11.10(GND) P11.11(NC) P11.12(GND) P11.19(GND) P12.4(GND) P12.5(GND) P12.6(GND) P12.10(GND) P12.11(NC) P12.12(GND) P12.20(GND) U3.4(GND) U3.7(GND) U4.4(GND) U4.7(GND)
MASTER_DN5_N: P11.17(DN0) ; port MASTER_DN5_N
MASTER_DN5_P: P11.18(DP0) ; port MASTER_DN5_P
MASTER_DN9_N: P11.21(DN1) ; port MASTER_DN9_N
MASTER_DN9_P: P11.20(DP1) ; port MASTER_DN9_P
MASTER_DN10_N: U3.2(D-) ; port MASTER_DN10_N
MASTER_DN10_P: U3.3(D+) ; port MASTER_DN10_P
MASTER_DN11_N: U4.2(D-) ; port MASTER_DN11_N
MASTER_DN11_P: U4.3(D+) ; port MASTER_DN11_P
MASTER_SSRX_DN5_N: P12.18(SSRX-) ; port MASTER_SSRX_DN5_N
MASTER_SSRX_DN5_P: P12.19(SSRX+) ; port MASTER_SSRX_DN5_P
MASTER_SSRX_DN6_N: U3.5(StdA_SSRX-) ; port MASTER_SSRX_DN6_N
MASTER_SSRX_DN6_P: U3.6(StdA_SSRX+) ; port MASTER_SSRX_DN6_P
MASTER_SSRX_DN7_N: U4.5(StdA_SSRX-) ; port MASTER_SSRX_DN7_N
MASTER_SSRX_DN7_P: U4.6(StdA_SSRX+) ; port MASTER_SSRX_DN7_P
MASTER_SSTX_DN5_N: C15.1 P12.21(SSTX-)
MASTER_SSTX_DN5_P: C16.1 P12.22(SSTX+)
MASTER_SSTX_DN6_N: C11.2 U3.9(StdA_SSTX+)
MASTER_SSTX_DN6_P: C12.2 U3.8(StdA_SSTX-)
MASTER_SSTX_DN7_N: C14.1 U4.8(StdA_SSTX-)
MASTER_SSTX_DN7_P: C13.1 U4.9(StdA_SSTX+)
NetC11_1: C11.1 ; port MASTER_SSTX_DN6_P
NetC12_1: C12.1 ; port MASTER_SSTX_DN6_N
NetC13_2: C13.2 ; port MASTER_SSTX_DN7_P
NetC14_2: C14.2 ; port MASTER_SSTX_DN7_N
NetC15_2: C15.2 ; port MASTER_SSTX_DN5_N
NetC16_2: C16.2 ; port MASTER_SSTX_DN5_P
NetP2_16: P12.16(CLK) ; port MASTER_I2C_CLK
NetP2_17: P12.17(DATA) ; port MASTER_I2C_D

### Layout directives
differential pair; rule Signal Stimulus [Kind - Single Pulse    Level - High    Start Time = 0.000    Stop Time = 200.0p    Period Time = 400.0p]: (no net found under the mark), MASTER_DN5_N, MASTER_DN5_P, MASTER_DN9_N, MASTER_DN9_P, MASTER_DN10_N, MASTER_DN10_P, MASTER_DN11_N, MASTER_DN11_P, MASTER_SSRX_DN5_N, MASTER_SSRX_DN5_P, MASTER_SSRX_DN6_N, MASTER_SSRX_DN6_P, MASTER_SSRX_DN7_N, MASTER_SSRX_DN7_P, MASTER_SSTX_DN7_N, MASTER_SSTX_DN7_P
differential pair: MASTER_SSTX_DN6_N, MASTER_SSTX_DN6_P

### Notes on the sheet
- (in symbol Molex_USB_3.0_WM10421_ND) Molex_USB_3.0; WM10421_ND
- (in symbol SATA 2) P#

### Library data of the parts
C11-C16 = Cap: Capacitor; Published: 8-Jun-2000; LatestRevisionDate: 17-Jul-2002; LatestRevisionNote: Re-released for DXP Platform.; PackageReference: RAD-0.3; Publisher: Altium Limited; PackageDescription: Radial Cap, Thru-Hole; 2 Leads; 0.3 in Pin Spacing
P11 = SATA 1: as P3 on sheet Outgoing_connectors_1_to_3; Supplier 1: Digi-Key
P12 = SATA 2: as P6 on sheet Outgoing_connectors_1_to_3; Supplier 1: Digi-Key
U3 U4 = Molex_USB_3.0_WM10421_ND: USB 3.0 Type A Receptacle Connector 9 Position Through Hole; Manufacturer: Molex; Manufacturer Profuct #: 0484080003; Price (CAD): 1.98; ComponentLink1Description: Datasheet; ComponentLink1URL: media.digikey.com/pdf/Data%20Sheets/Molex%20PDFs/48408-001_Pkg%20Spec.pdf; ComponentLink2Description: Datasheet_Model; ComponentLink2URL: molex.com/pdm_docs/sd/484080003_sd.pdf

## Sheet Outgoing_Connector_8.SchDoc
size A4
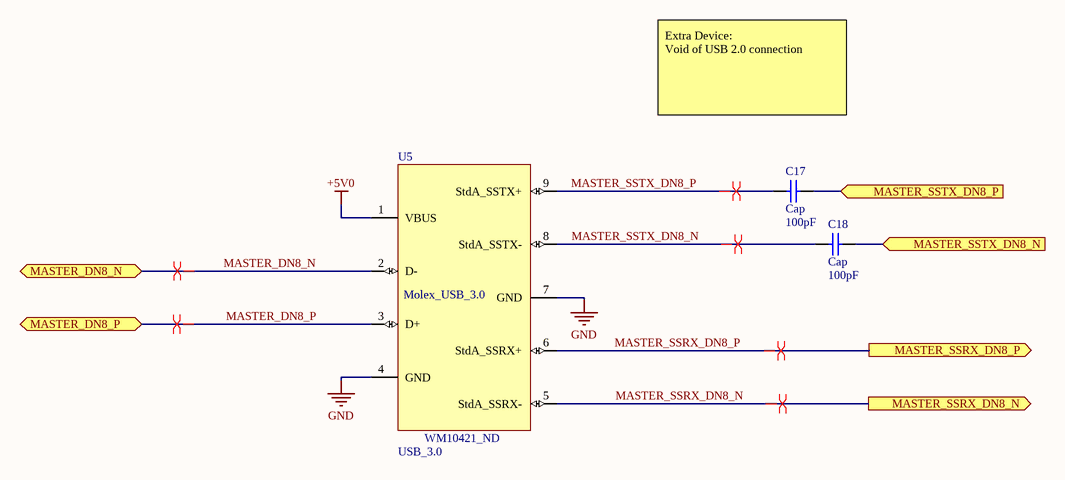
[diagram p8: Outgoing_Connector_8.SchDoc]

### Parts
C17  Cap  value 100pF  [RAD-0.3]
C18  Cap  value 100pF  [RAD-0.3]
U5  USB_3.0  [Molex_USB_3.0_WM10421_ND]

### Ports
MASTER_DN8_N (bidir), MASTER_DN8_P (bidir), MASTER_SSRX_DN8_N (out), MASTER_SSRX_DN8_P (out), MASTER_SSTX_DN8_N (in), MASTER_SSTX_DN8_P (in)

### Nets
+5V0: U5.1(VBUS)
GND: U5.4(GND) U5.7(GND)
 MASTER_DN8_N: U5.2(D-) ; port MASTER_DN8_N
 MASTER_DN8_P: U5.3(D+) ; port MASTER_DN8_P
MASTER_SSRX_DN8_N: U5.5(StdA_SSRX-) ; port MASTER_SSRX_DN8_N
MASTER_SSRX_DN8_P: U5.6(StdA_SSRX+) ; port MASTER_SSRX_DN8_P
MASTER_SSTX_DN8_N: C18.1 U5.8(StdA_SSTX-)
MASTER_SSTX_DN8_P: C17.1 U5.9(StdA_SSTX+)
NetC17_2: C17.2 ; port MASTER_SSTX_DN8_P
NetC18_2: C18.2 ; port MASTER_SSTX_DN8_N

### Layout directives
differential pair:  MASTER_DN8_N,  MASTER_DN8_P, MASTER_SSRX_DN8_N, MASTER_SSRX_DN8_P, MASTER_SSTX_DN8_N, MASTER_SSTX_DN8_P

### Notes on the sheet
- Extra Device:
  Void of USB 2.0 connection
- (in symbol Molex_USB_3.0_WM10421_ND) Molex_USB_3.0; WM10421_ND

### Library data of the parts
C17 C18 = Cap: Capacitor; Published: 8-Jun-2000; LatestRevisionDate: 17-Jul-2002; LatestRevisionNote: Re-released for DXP Platform.; PackageReference: RAD-0.3; Publisher: Altium Limited; PackageDescription: Radial Cap, Thru-Hole; 2 Leads; 0.3 in Pin Spacing
U5 = Molex_USB_3.0_WM10421_ND: as U3 on sheet Outgoing_connectors_5_to_7; Price (CAD): 1.98; ComponentLink1Description: Datasheet; ComponentLink1URL: media.digikey.com/pdf/Data%20Sheets/Molex%20PDFs/48408-001_Pkg%20Spec.pdf; ComponentLink2Description: Datasheet_Model; ComponentLink2URL: molex.com/pdm_docs/sd/484080003_sd.pdf

## Sheet Incoming_connectors2.SchDoc
size A4
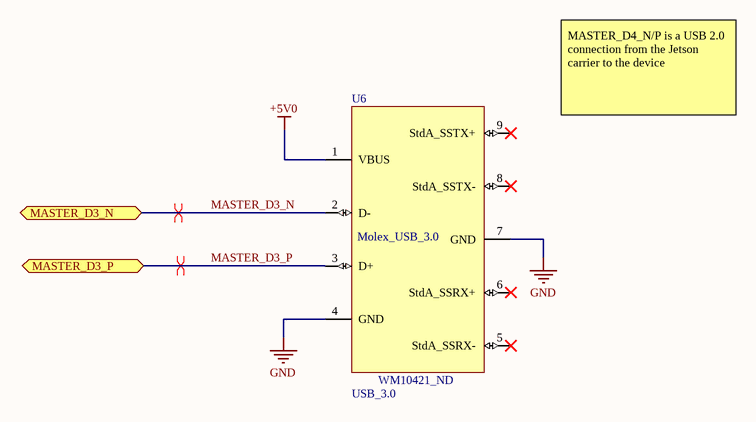
[diagram p9: Incoming_connectors2.SchDoc]

### Parts
U6  USB_3.0  [Molex_USB_3.0_WM10421_ND]

### Ports
MASTER_D3_N (bidir), MASTER_D3_P (bidir)

### Nets
+5V0: U6.1(VBUS)
GND: U6.4(GND) U6.7(GND)
MASTER_D3_N: U6.2(D-) ; port MASTER_D3_N
MASTER_D3_P: U6.3(D+) ; port MASTER_D3_P

Not connected (* = marked no-connect by the designer): U6 5(StdA_SSRX-)* 6(StdA_SSRX+)* 8(StdA_SSTX-)* 9(StdA_SSTX+)*

### Layout directives
differential pair; rule Signal Stimulus [Kind - Single Pulse    Level - High    Start Time = 0.000    Stop Time = 2.083n    Period Time = 4.167n]: MASTER_D3_N, MASTER_D3_P

### Notes on the sheet
- MASTER_D4_N/P is a USB 2.0  connection from the Jetson carrier to the device
- (in symbol Molex_USB_3.0_WM10421_ND) Molex_USB_3.0; WM10421_ND

### Library data of the parts
U6 = Molex_USB_3.0_WM10421_ND: as U3 on sheet Outgoing_connectors_5_to_7; Price (CAD): 1.98; ComponentLink1Description: Datasheet; ComponentLink1URL: media.digikey.com/pdf/Data%20Sheets/Molex%20PDFs/48408-001_Pkg%20Spec.pdf; ComponentLink2Description: Datasheet_Model; ComponentLink2URL: molex.com/pdm_docs/sd/484080003_sd.pdf

## Nets that join several sheets
+3V3: USB_hub (U1.18 U1.38 U1.56 U1.71), Outgoing_connectors_1_to_3 (9 pins), Outgoing_Connector_4 (P9.1 P9.2 P9.3), Incoming_connectors (P1.1 P1.2 P1.3), SD_Card (J1.4 J2.4), USB_hub2 (U2.18 U2.38 U2.56 U2.71), Outgoing_connectors_5_to_7 (P11.1 P11.2 P11.3)
+5V0: Outgoing_connectors_1_to_3 (24 pins), Outgoing_Connector_4 (8 pins), Incoming_connectors (8 pins), Outgoing_connectors_5_to_7 (10 pins), Outgoing_Connector_8 (U5.1), Incoming_connectors2 (U6.1)
+12V0: Outgoing_connectors_1_to_3 (27 pins), Outgoing_Connector_4 (9 pins), Incoming_connectors (9 pins), Outgoing_connectors_5_to_7 (9 pins)
GND: USB_hub (R1.2 U1.1-2), Outgoing_connectors_1_to_3 (42 pins), Outgoing_Connector_4 (14 pins), Incoming_connectors (14 pins), SD_Card (J1.6 J2.6), USB_hub2 (R2.2 U2.1-2), Outgoing_connectors_5_to_7 (18 pins), Outgoing_Connector_8 (U5.4 U5.7), Incoming_connectors2 (U6.4 U6.7)
 MASTER_DN8_N: USB_hub2 (U2.27), Outgoing_Connector_8 (U5.2)
 MASTER_DN8_P: USB_hub2 (U2.26), Outgoing_Connector_8 (U5.3)
MASTER_D0_N: USB_hub (U1.62), Incoming_connectors (P1.17)
MASTER_D0_P: USB_hub (U1.61), Incoming_connectors (P1.18)
MASTER_D1_N: Outgoing_Connector_4 (P9.21), Incoming_connectors (P1.20)
MASTER_D1_P: Outgoing_Connector_4 (P9.20), Incoming_connectors (P1.21)
MASTER_D3_N: USB_hub2 (U2.62), Incoming_connectors2 (U6.2)
MASTER_D3_P: USB_hub2 (U2.61), Incoming_connectors2 (U6.3)
MASTER_DN1_N: USB_hub (U1.4), Outgoing_connectors_1_to_3 (P3.17)
MASTER_DN1_P: USB_hub (U1.3), Outgoing_connectors_1_to_3 (P3.18)
MASTER_DN2_N: USB_hub (U1.12), Outgoing_connectors_1_to_3 (P4.17)
MASTER_DN2_P: USB_hub (U1.11), Outgoing_connectors_1_to_3 (P4.18)
MASTER_DN3_N: USB_hub (U1.20), Outgoing_connectors_1_to_3 (P5.17)
MASTER_DN3_P: USB_hub (U1.19), Outgoing_connectors_1_to_3 (P5.18)
MASTER_DN4_N: USB_hub (U1.27), Outgoing_Connector_4 (P9.17)
MASTER_DN4_P: USB_hub (U1.26), Outgoing_Connector_4 (P9.18)
MASTER_DN5_N: USB_hub (U1.33), Outgoing_connectors_1_to_3 (P3.21), USB_hub2 (U2.4), Outgoing_connectors_5_to_7 (P11.17)
MASTER_DN5_P: USB_hub (U1.34), Outgoing_connectors_1_to_3 (P3.20), USB_hub2 (U2.3), Outgoing_connectors_5_to_7 (P11.18)
MASTER_DN6_N: USB_hub (U1.57), Outgoing_connectors_1_to_3 (P4.21), USB_hub2 (U2.12)
MASTER_DN6_P: USB_hub (U1.58), Outgoing_connectors_1_to_3 (P4.20), USB_hub2 (U2.11)
MASTER_DN7_N: USB_hub (U1.59), Outgoing_connectors_1_to_3 (P5.21), USB_hub2 (U2.20)
MASTER_DN7_P: USB_hub (U1.60), Outgoing_connectors_1_to_3 (P5.20), USB_hub2 (U2.19)
MASTER_DN9_N: USB_hub2 (U2.33), Outgoing_connectors_5_to_7 (P11.21)
MASTER_DN9_P: USB_hub2 (U2.34), Outgoing_connectors_5_to_7 (P11.20)
MASTER_DN10_N: USB_hub2 (U2.57), Outgoing_connectors_5_to_7 (U3.2)
MASTER_DN10_P: USB_hub2 (U2.58), Outgoing_connectors_5_to_7 (U3.3)
MASTER_DN11_N: USB_hub2 (U2.59), Outgoing_connectors_5_to_7 (U4.2)
MASTER_DN11_P: USB_hub2 (U2.60), Outgoing_connectors_5_to_7 (U4.3)
MASTER_SSRX_DN1_N: USB_hub (U1.9), Outgoing_connectors_1_to_3 (P7.18)
MASTER_SSRX_DN1_P: USB_hub (U1.8), Outgoing_connectors_1_to_3 (P7.19)
MASTER_SSRX_DN2_N: USB_hub (U1.17), Outgoing_connectors_1_to_3 (P8.18)
MASTER_SSRX_DN2_P: USB_hub (U1.16), Outgoing_connectors_1_to_3 (P8.19)
MASTER_SSRX_DN3_N: USB_hub (U1.25), Outgoing_connectors_1_to_3 (P6.18)
MASTER_SSRX_DN3_P: USB_hub (U1.24), Outgoing_connectors_1_to_3 (P6.19)
MASTER_SSRX_DN4_N: USB_hub (U1.32), Outgoing_Connector_4 (P10.18)
MASTER_SSRX_DN4_P: USB_hub (U1.31), Outgoing_Connector_4 (P10.19)
MASTER_SSRX_DN5_N: USB_hub2 (U2.9), Outgoing_connectors_5_to_7 (P12.18)
MASTER_SSRX_DN5_P: USB_hub2 (U2.8), Outgoing_connectors_5_to_7 (P12.19)
MASTER_SSRX_DN6_N: USB_hub2 (U2.17), Outgoing_connectors_5_to_7 (U3.5)
MASTER_SSRX_DN6_P: USB_hub2 (U2.16), Outgoing_connectors_5_to_7 (U3.6)
MASTER_SSRX_DN7_N: USB_hub2 (U2.25), Outgoing_connectors_5_to_7 (U4.5)
MASTER_SSRX_DN7_P: USB_hub2 (U2.24), Outgoing_connectors_5_to_7 (U4.6)
MASTER_SSRX_DN8_N: USB_hub2 (U2.32), Outgoing_Connector_8 (U5.5)
MASTER_SSRX_DN8_P: USB_hub2 (U2.31), Outgoing_Connector_8 (U5.6)
MASTER_SSRX_N: USB_hub (U1.64), Incoming_connectors (P2.18)
MASTER_SSRX_P: USB_hub (U1.63), Incoming_connectors (P2.19)
NetC1_2: USB_hub (U1.67), Incoming_connectors (C1.2)
NetC2_2: USB_hub (U1.66), Incoming_connectors (C2.2)
NetC3_2: USB_hub (U1.22), Outgoing_connectors_1_to_3 (C3.2)
NetC4_2: USB_hub (U1.21), Outgoing_connectors_1_to_3 (C4.2)
NetC5_2: USB_hub (U1.6), Outgoing_connectors_1_to_3 (C5.2)
NetC6_2: USB_hub (U1.5), Outgoing_connectors_1_to_3 (C6.2)
NetC7_2: USB_hub (U1.14), Outgoing_connectors_1_to_3 (C7.2)
NetC8_2: USB_hub (U1.13), Outgoing_connectors_1_to_3 (C8.2)
NetC9_2: USB_hub (U1.29), Outgoing_Connector_4 (C9.2)
NetC10_2: USB_hub (U1.28), Outgoing_Connector_4 (C10.2)
NetC11_1: USB_hub2 (U2.13), Outgoing_connectors_5_to_7 (C11.1)
NetC12_1: USB_hub2 (U2.14), Outgoing_connectors_5_to_7 (C12.1)
NetC13_2: USB_hub2 (U2.21), Outgoing_connectors_5_to_7 (C13.2)
NetC14_2: USB_hub2 (U2.22), Outgoing_connectors_5_to_7 (C14.2)
NetC15_2: USB_hub2 (U2.6), Outgoing_connectors_5_to_7 (C15.2)
NetC16_2: USB_hub2 (U2.5), Outgoing_connectors_5_to_7 (C16.2)
NetC17_2: USB_hub2 (U2.28), Outgoing_Connector_8 (C17.2)
NetC18_2: USB_hub2 (U2.29), Outgoing_Connector_8 (C18.2)
NetJ1_2: USB_hub (U1.43), SD_Card (J1.2)
NetJ1_3: USB_hub (U1.45), SD_Card (J1.3)
NetJ1_5: USB_hub (U1.44), SD_Card (J1.5)
NetJ1_7: USB_hub (U1.46), SD_Card (J1.7)
NetJ2_2: SD_Card (J2.2), USB_hub2 (U2.43)
NetJ2_3: SD_Card (J2.3), USB_hub2 (U2.45)
NetJ2_5: SD_Card (J2.5), USB_hub2 (U2.44)
NetJ2_7: SD_Card (J2.7), USB_hub2 (U2.46)
NetP2_16: Outgoing_connectors_1_to_3 (P6.16 P7.16 P8.16), Outgoing_Connector_4 (P10.16), Incoming_connectors (P2.16), Outgoing_connectors_5_to_7 (P12.16)
NetP2_17: Outgoing_connectors_1_to_3 (P6.17 P7.17 P8.17), Outgoing_Connector_4 (P10.17), Incoming_connectors (P2.17), Outgoing_connectors_5_to_7 (P12.17)